# EAGLE schematic Fingerprint (EAGLE 9.2.2)
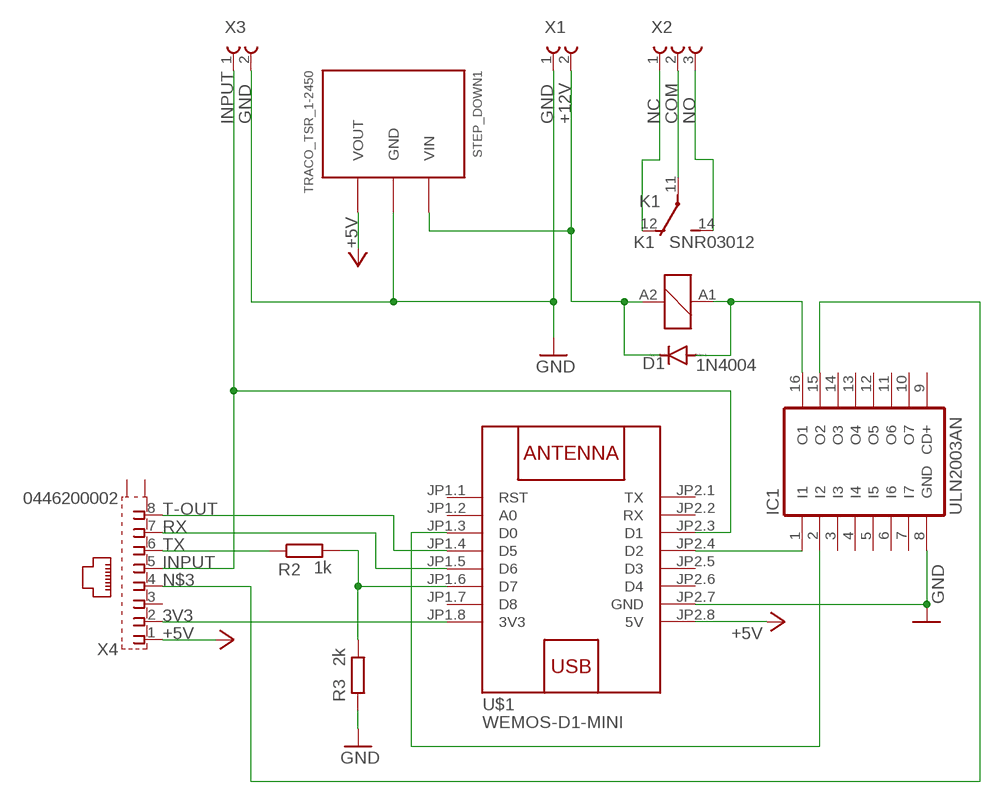
[diagram p0: schematic, sheet 1]

## Parts
D1  1N4004  [DO41-10]
IC1  ULN2003AN  [DIL16]
K1  SNR03012  [SNR-V]
R2  1k  R-EU_0207/10  [0207/10]
R3  2k  R-EU_0207/10  [0207/10]
STEP_DOWN1  TRACO_TSR_1-2450  [TRACO_TSR_1-2450]
U$1  WEMOS-D1-MINI  [WEMOS-D1-MINI]
X1  2PIN_5MM_TERMINAL  [2PIN_5MM_TERMMINAL]
X2  3PIN_5MM_TERMINAL  [3PIN_5MM_TERMINAL]
X3  2PIN_5MM_TERMINAL  [2PIN_5MM_TERMMINAL]
X4  0446200002  [0446200002]

## Nets
3V3: U$1.JP1.8(3V3) X4.2
+5V: STEP_DOWN1.VOUT U$1.JP2.8(5V) X4.1
+12V: D1.C K1.A2 STEP_DOWN1.VIN X1.2
COM: K1.11(2:P) X2.2
GND: IC1.8(GND) R3.2 STEP_DOWN1.GND U$1.JP2.7(GND) X1.1 X3.2
INPUT: U$1.JP2.3(D1) X3.1 X4.5
N$1: D1.A IC1.16(O1) K1.A1
N$2: IC1.2(I2) U$1.JP1.3(D0)
N$3: IC1.15(O2) X4.4
N$6: R2.2 R3.1 U$1.JP1.6(D7)
N$16: IC1.1(I1) U$1.JP2.4(D2)
NC: K1.12(2:O) X2.1
NO: K1.14(2:S) X2.3
RX: U$1.JP1.5(D6) X4.7
T-OUT: U$1.JP1.4(D5) X4.8
TX: R2.1 X4.6
Unconnected: IC1.3(I3) IC1.4(I4) IC1.5(I5) IC1.6(I6) IC1.7(I7) IC1.9(CD+) IC1.10(O7) IC1.11(O6) IC1.12(O5) IC1.13(O4) IC1.14(O3) U$1.JP1.1(RST) U$1.JP1.2(A0) U$1.JP1.7(D8) U$1.JP2.1(TX) U$1.JP2.2(RX) U$1.JP2.5(D3) U$1.JP2.6(D4) X4.3 X4.S@1(S1) X4.S@2(S2)

## Library data of the parts
D1 = diode:1N4004: DIODE general purpose rectifier, 1 A
IC1 = ULN:ULN2003A: DRIVER ARRAY
K1 = relay:SNR?*: Slim PCB Relay 1 pole 6 A SCHRACK Source: http://www.schrack.com/.. 5815.pdf; OC_FARNELL: unknown; OC_NEWARK: unknown
R2 R3 = rcl:R-EU_: RESISTOR, European symbol; SPICEPREFIX: R
STEP_DOWN1 = Voltage:TRACO_TSR_1-2450
U$1 = Sbirka modulu:WEMOS-D1-MINI: WEMOS D1 mini: Mini Wi-Fi Board based on ESP-8266 device More details can be found here: https://www.wemos.cc/product/d1-mini.html Click here to find device on ebay.com <http://www.ebay.com/sch/wemos+d1+mini+nodemcu>
X1 X3 = Terminaly:2PIN_5MM_TERMINAL
X2 = Terminaly:3PIN_5MM_TERMINAL
X4 = con-molex:0446200002: RJ-45 INVERTED MODULAR JACK ASSEMBLY WITH RJ-11 KEEPOUT FEATURE Source: Data sheet <http://www.farnell.com/datasheets/73207.pdf> MOLEX 0446200002 BUCHSE, RJ45, GESCHIRMT Source: Farnell <http://de.farnell.com/molex/0446200002/buchse-rj45-geschirmt/dp/9251910?ost=9251910>; MF: MOLEX; MPN: 0446200002; OC_FARNELL: 9251910

## Net classes
1 rele: width 1.778 mm